# Altium schematic sheet omoko_Battery_Charger.SchDoc
size 457 x 381 mm; PageSetup: Record=PageOptions|CenterHorizontal=True|CenterVertical=True|PrintScale=0.54|XCorrection=1.00|YCorrection=1.00|PrintKind=1|BorderSize=5000000|LeftOffset=0|BottomOffset=0|Orientation=2|PaperLength=1000|PaperWidth=1000|Scale=100|PaperSource=7|PrintQuality=-3|MediaType=1|DitherType=10|PrintScaleMode=1|PaperKind=Executive|PaperIndex=7
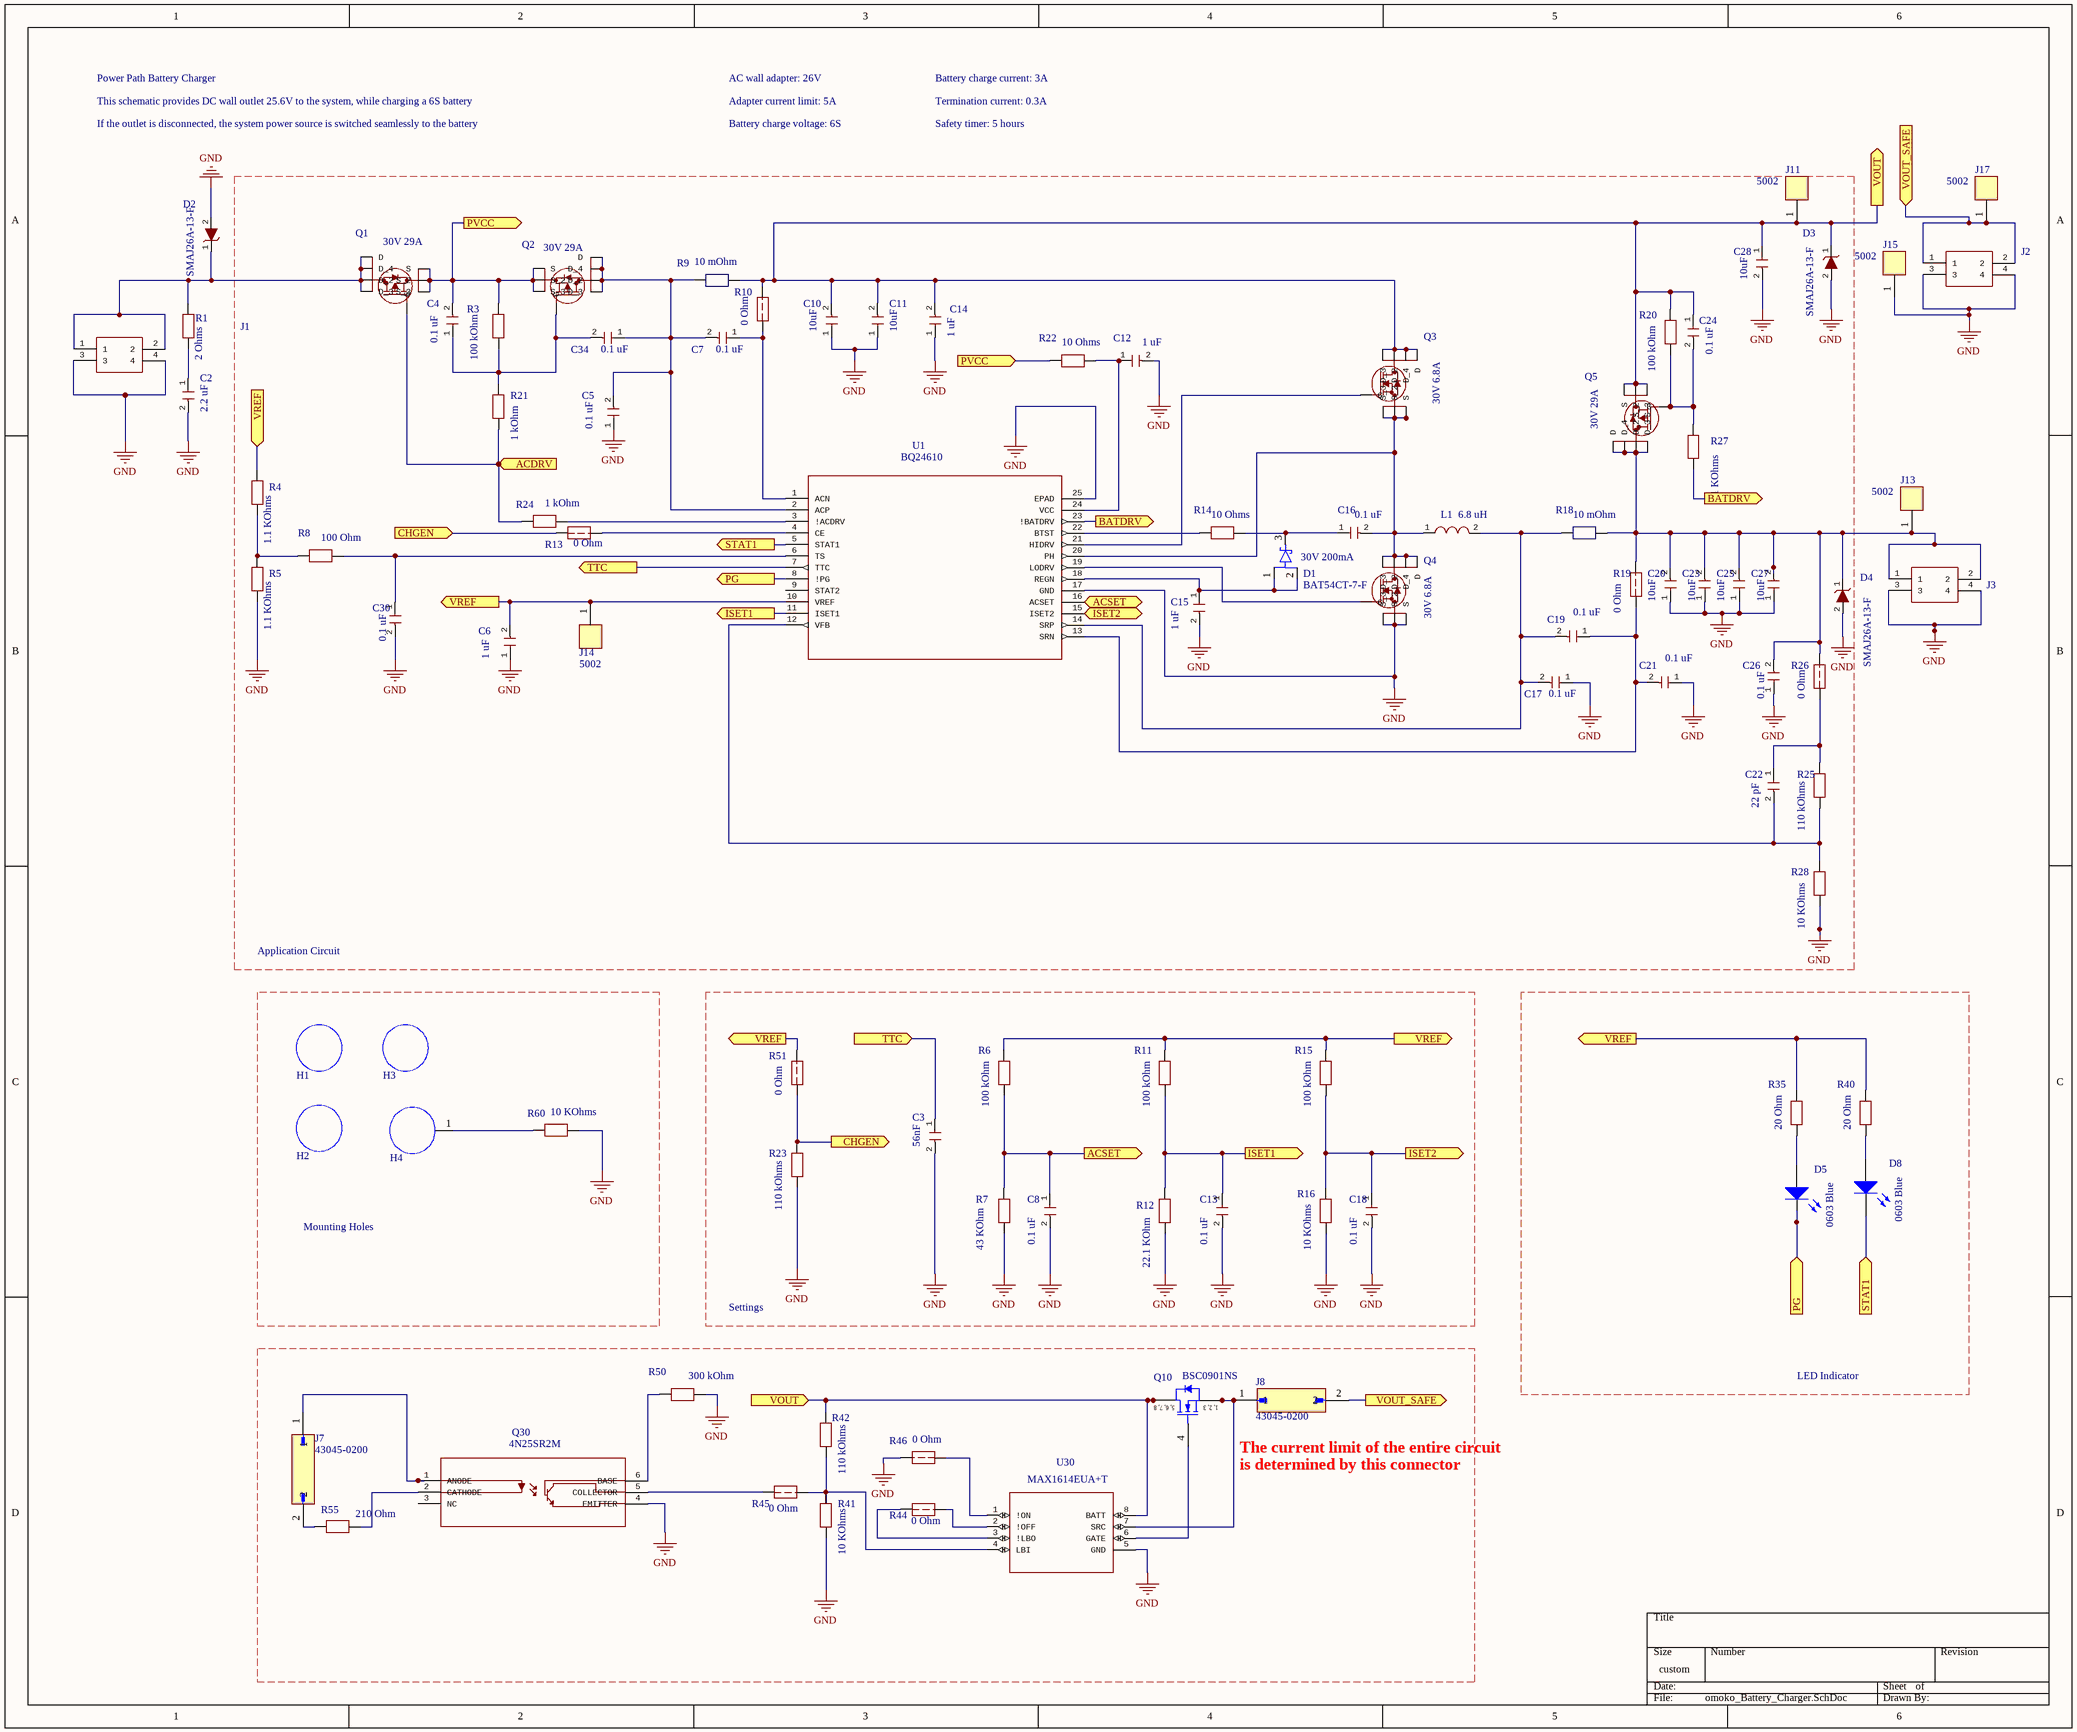
[diagram p0: omoko_Battery_Charger.SchDoc]

## Parts
C2  value 2.2 uF  [CAP_0603]  (hidden comment: GRM188R6YA225KA12D)
C3  value 56nF  [RES_0603]  (hidden comment: CC0603KRX7R9BB563)
C4  value 0.1 uF  [CAP_0603]  (hidden comment: CL10B104KB8NNNC)
C5  value 0.1 uF  [CAP_0603]  (hidden comment: CL10B104KB8NNNC)
C6  value 1 uF  [CAP_0603]  (hidden comment: GCM188R71C105KA64)
C7  value 0.1 uF  [CAP_0603]  (hidden comment: CL10B104KB8NNNC)
C8  value 0.1 uF  [CAP_0603]  (hidden comment: CL10B104KB8NNNC)
C10  value 10uF  [CAP_1210]  (hidden comment: GRM32ER71H106KA12L)
C11  value 10uF  [CAP_1210]  (hidden comment: GRM32ER71H106KA12L)
C12  value 1 uF  [CAP_0603]  (hidden comment: GRT188R61H105KE13D)
C13  value 0.1 uF  [CAP_0603]  (hidden comment: CL10B104KB8NNNC)
C14  value 1 uF  [CAP_0603]  (hidden comment: GRT188R61H105KE13D)
C15  value 1 uF  [CAP_0603]  (hidden comment: GCM188R71C105KA64)
C16  value 0.1 uF  [CAP_0603]  (hidden comment: CL10B104KB8NNNC)
C17  value 0.1 uF  [CAP_0603]  (hidden comment: CL10B104KB8NNNC)
C18  value 0.1 uF  [CAP_0603]  (hidden comment: CL10B104KB8NNNC)
C19  value 0.1 uF  [CAP_0603]  (hidden comment: CL10B104KB8NNNC)
C20  value 10uF  [CAP_1210]  (hidden comment: GRM32ER71H106KA12L)
C21  value 0.1 uF  [CAP_0603]  (hidden comment: CL10B104KB8NNNC)
C22  value 22 pF  [CAP_0603]  (hidden comment: CL10C220JB8NNNC)
C23  value 10uF  [CAP_1210]  (hidden comment: GRM32ER71H106KA12L)
C24  value 0.1 uF  [CAP_0603]  (hidden comment: CL10B104KB8NNNC)
C25  value 10uF  [CAP_1210]  (hidden comment: GRM32ER71H106KA12L)
C26  value 0.1 uF  [CAP_0603]  (hidden comment: CL10B104KB8NNNC)
C27  value 10uF  [CAP_1210]  (hidden comment: GRM32ER71H106KA12L)
C28  value 10uF  [CAP_1210]  (hidden comment: GRM32ER71H106KA12L)
C30  value 0.1 uF  [CAP_0603]  (hidden comment: CL10B104KB8NNNC)
C34  value 0.1 uF  [CAP_0603]  (hidden comment: CL10B104KB8NNNC)
D1  BAT54CT-7-F  value 30V 200mA  [DIODE_SOT-523]
D2  SMAJ26A-13-F  [DIODE_DO-214AC]
D3  SMAJ26A-13-F  [DIODE_DO-214AC]
D4  SMAJ26A-13-F  [DIODE_DO-214AC]
D5  0603 Blue  [0603_LED_S1]
D8  0603 Blue  [0603_LED_S1]
H1  M3 not plated  [M3 not plated]  (value not drawn)
H2  M3 not plated  [M3 not plated]  (value not drawn)
H3  M3 not plated  [M3 not plated]  (value not drawn)
H4  M3 plated  [M3 plated]  (value not drawn)
J1  4 way r/a PCB header w/peg,Mini-Fit Jr Molex MINI-FIT JR. Series, Series Number 5569, 4.2mm Pitch 4 Way 2 Row Shrouded Right Angle PCB Header, Through Hole   Source:  Datasheet  [MOLEX_39-30-1040]  (value not drawn)
J2  4 way r/a PCB header w/peg,Mini-Fit Jr Molex MINI-FIT JR. Series, Series Number 5569, 4.2mm Pitch 4 Way 2 Row Shrouded Right Angle PCB Header, Through Hole   Source:  Datasheet  [MOLEX_39-30-1040]  (value not drawn)
J3  4 way r/a PCB header w/peg,Mini-Fit Jr Molex MINI-FIT JR. Series, Series Number 5569, 4.2mm Pitch 4 Way 2 Row Shrouded Right Angle PCB Header, Through Hole   Source:  Datasheet  [MOLEX_39-30-1040]  (value not drawn)
J7  43045-0200  [MOLEX_43045-0200]
J8  43045-0200  [MOLEX_43045-0200]
J11  5002  [KEYSTONE_5002]
J13  5002  [KEYSTONE_5002]
J14  5002  [KEYSTONE_5002]
J15  5002  [KEYSTONE_5002]
J17  5002  [KEYSTONE_5002]
L1  value 6.8 uH  [IND_5450]  (hidden comment: ASPI-1367-6R8M-T)
Q1  value 30V 29A  [MOSFET_SOIC-8]  (hidden comment: SI4459ADY)
Q2  value 30V 29A  [MOSFET_SOIC-8]  (hidden comment: SI4459ADY)
Q3  value 30V 6.8A  [MOSFET-SO-8]  (hidden comment: NTMS4816NR2G)
Q4  value 30V 6.8A  [MOSFET-SO-8]  (hidden comment: NTMS4816NR2G)
Q5  value 30V 29A  [MOSFET_SOIC-8]  (hidden comment: SI4459ADY)
Q10  BSC0901NS  [MOSFET_PG-TDSON-8(6x5)]
Q30  4N25SR2M  [OPTO_SMD-6]
R1  value 2 Ohms  [RES_2512]  (hidden comment: AC2512FK-072RL)
R3  value 100 kOhm  [RES_0603]  (hidden comment: ERJ3GEYJ104V)
R4  value 1.1 KOhms  [RES_0603]  (hidden comment: ERJ3EKF1101V)
R5  value 1.1 KOhms  [RES_0603]  (hidden comment: ERJ3EKF1101V)
R6  value 100 kOhm  [RES_0603]  (hidden comment: ERJ3GEYJ104V)
R7  value 43 KOhm  [RES_0603]  (hidden comment: ERJ3GEYJ433V)
R8  value 100 Ohm  [RES_0603]  (hidden comment: ERJU3RD1000V)
R9  value 10 mOhm  [RES_0805]  (hidden comment: ERJ6CWFR010V)
R10  value 0 Ohm  [RES_0603]  (hidden comment: ERJ3GEY0R00V)
R11  value 100 kOhm  [RES_0603]  (hidden comment: ERJ3GEYJ104V)
R12  value 22.1 KOhm  [RES_0603]  (hidden comment: ERJ3RBD2212V)
R13  value 0 Ohm  [RES_0603]  (hidden comment: ERJ3GEY0R00V)
R14  value 10 Ohms  [RES_0805]  (hidden comment: ERJ-P06F10R0V)
R15  value 100 kOhm  [RES_0603]  (hidden comment: ERJ3GEYJ104V)
R16  value 10 KOhms  [RES_0603]  (hidden comment: ERJ3GEYJ103V)
R18  value 10 mOhm  [RES_0805]  (hidden comment: ERJ6CWFR010V)
R19  value 0 Ohm  [RES_0603]  (hidden comment: ERJ3GEY0R00V)
R20  value 100 kOhm  [RES_0603]  (hidden comment: ERJ3GEYJ104V)
R21  value 1 kOhm  [RES_0603]  (hidden comment: ERJ3GEYJ102V)
R22  value 10 Ohms  [RES_0805]  (hidden comment: ERJ-P06F10R0V)
R23  value 110 kOhms  [RES_0603]  (hidden comment: ERJ3EKF1103V)
R24  value 1 kOhm  [RES_0603]  (hidden comment: ERJ3GEYJ102V)
R25  value 110 kOhms  [RES_0603]  (hidden comment: ERJ3EKF1103V)
R26  value 0 Ohm  [RES_0603]  (hidden comment: ERJ3GEY0R00V)
R27  value 1.1 KOhms  [RES_0603]  (hidden comment: ERJ3EKF1101V)
R28  value 10 KOhms  [RES_0603]  (hidden comment: ERJ3GEYJ103V)
R35  value 20 Ohm  [RES_0603]  (hidden comment: ERJ3GEYJ200V)
R40  value 20 Ohm  [RES_0603]  (hidden comment: ERJ3GEYJ200V)
R41  value 10 KOhms  [RES_0603]  (hidden comment: ERJ3GEYJ103V)
R42  value 110 kOhms  [RES_0603]  (hidden comment: ERJ3EKF1103V)
R44  value 0 Ohm  [RES_0603]  (hidden comment: ERJ3GEY0R00V)
R45  value 0 Ohm  [RES_0603]  (hidden comment: ERJ3GEY0R00V)
R46  value 0 Ohm  [RES_0603]  (hidden comment: ERJ3GEY0R00V)
R50  value 300 kOhm  [RES_0603]  (hidden comment: ERJ3GEYJ304V)
R51  value 0 Ohm  [RES_0603]  (hidden comment: ERJ3GEY0R00V)
R55  value 210 Ohm  [RES_0603]  (hidden comment: ERJ3EKF2100V)
R60  value 10 KOhms  [RES_0603]  (hidden comment: ERJ3GEYJ103V)
U1  BQ24610  [QFN-24_EP_4.0x4.0x0.5P]
U30  MAX1614EUA+T  [DRIVER_MSOP-8]

## Blocks framed on the sheet
Application Circuit: C4-C7 C10-C12 C14-C17 C19-C28 C30 C34 D1 D3 D4 J11 J14 L1 Q1-Q5 R3-R5 R8-R10 R13 R14 R18-R22 R24-R28 U1
Mounting Holes: H1-H4 R60
Settings: C3 C8 C13 C18 R6 R7 R11 R12 R15 R16 R23 R51
LED Indicator: D5 D8 R35 R40

## Ports
ACDRV (in), ACSET (out), BATDRV (out), CHGEN (in), CHGEN (out), ISET1 (out), ISET2 (out), PG (in), PG (out), PVCC (in), PVCC (out), STAT1 (in), STAT1 (out), TTC (in), TTC (out), VOUT (in), VOUT (out), VOUT_SAFE (in), VOUT_SAFE (out), VREF (in), VREF (out)

## Nets
GND: C2.2 C3.2 C5.1 C6.1 C8.2 C10.1 C11.1 C12.2 C13.2 C14.1 C15.2 C17.1 C18.2 C20.1 C21.1 C23.1 C25.1 C26.1 C27.1 C28.2 C30.2 D2.2 D3.2 D4.2 J1.3 J1.4 J2.3 J2.4 J3.3 J3.4 J15.1 Q4.1(S_3) Q4.2(S_2) Q4.3(S) Q30.4(EMITTER) R5.1 R7.1 R12.1 R16.1 R23.1 R28.1 R41.1 R46.2 R50.2 R60.2 U1.17(GND) U1.25(EPAD) U30.5(GND)
ACDRV: Q1.4(G) R21.1 R24.1 ; port ACDRV
ACSET: C8.1 R6.1 R7.2 U1.16(ACSET) ; port ACSET
BATDRV: R27.1 U1.23(!BATDRV) ; port BATDRV
CHGEN: R13.1 R23.2 R51.1 ; port CHGEN
ISET1: C13.1 R11.1 R12.2 U1.11(ISET1) ; port ISET1
ISET2: C18.1 R15.1 R16.2 U1.15(ISET2) ; port ISET2
PG: D5.K U1.8(!PG) ; port PG
PVCC: C4.2 Q1.1(S_3) Q1.2(S_2) Q1.3(S) Q2.1(S_3) Q2.2(S_2) Q2.3(S) R3.2 R22.1 ; port PVCC
STAT1: D8.K U1.5(STAT1) ; port STAT1
TTC: C3.1 U1.7(TTC) ; port TTC
VOUT: C10.2 C11.2 C14.2 C24.1 C28.1 D3.1 J11.1 Q3.5(D_3) Q3.6(D_2) Q3.7(D_4) Q3.8(D) Q5.1(S_3) Q5.2(S_2) Q5.3(S) Q10.5(DRAIN) Q10.6(DRAIN) Q10.7(DRAIN) Q10.8(DRAIN) R9.2 R10.2 R20.2 R42.2 U30.8(BATT) ; port VOUT
VOUT_SAFE: J2.1 J2.2 J8.2 J17.1 ; port VOUT_SAFE
VREF: C6.2 J14.1 R4.2 R6.2 R11.2 R15.2 R35.2 R40.2 R51.2 U1.10(VREF) ; port VREF
NetC2_1: C2.1 R1.1
NetC4_1: C4.1 C34.2 Q2.4(G) R3.1 R21.2
NetC5_2: C5.2 C7.2 C34.1 Q2.5(D_3) Q2.6(D_2) Q2.7(D_4) Q2.8(D) R9.1 U1.2(ACP)
NetC7_1: C7.1 R10.1 U1.1(ACN)
NetC12_1: C12.1 R22.2 U1.24(VCC)
NetC15_1: C15.1 D1.1(A_1) D1.2(A_2) U1.18(REGN)
NetC16_1: C16.1 D1.3(K) R14.2
NetC16_2: C16.2 L1.1 Q3.1(S_3) Q3.2(S_2) Q3.3(S) Q4.5(D_3) Q4.6(D_2) Q4.7(D_4) Q4.8(D) U1.20(PH)
NetC17_2: C17.2 C19.2 L1.2 R18.1 U1.14(SRP)
NetC19_1: C19.1 C21.2 R19.1 U1.13(SRN)
NetC20_2: C20.2 C23.2 C25.2 C26.2 C27.2 D4.1 J3.1 J3.2 J13.1 Q5.5(D_3) Q5.6(D_2) Q5.7(D_4) Q5.8(D) R18.2 R19.2 R26.2
NetC22_1: C22.1 R25.2 R26.1
NetC22_2: C22.2 R25.1 R28.2 U1.12(VFB)
NetC24_2: C24.2 Q5.4(G) R20.1 R27.2
NetC30_1: C30.1 R8.2 U1.6(TS)
NetD2_1: D2.1 J1.1 J1.2 Q1.5(D_3) Q1.6(D_2) Q1.7(D_4) Q1.8(D) R1.2
NetD5_A: D5.A R35.1
NetD8_A: D8.A R40.1
NetH4_1: H4.1 R60.1
NetJ7_1: J7.1 Q30.1(ANODE)
NetJ7_2: J7.2 R55.1
NetJ8_1: J8.1 Q10.1(SOURCE) Q10.2(SOURCE) Q10.3(SOURCE) U30.7(SRC)
NetQ3_4: Q3.4(G) U1.21(HIDRV)
NetQ4_4: Q4.4(G) U1.19(LODRV)
NetQ10_4: Q10.4(GATE) U30.6(GATE)
NetQ30_2: Q30.2(CATHODE) R55.2
NetQ30_5: Q30.5(COLLECTOR) R45.1
NetQ30_6: Q30.6(BASE) R50.1
NetR4_1: R4.1 R5.2 R8.1
NetR13_2: R13.2 U1.4(CE)
NetR14_1: R14.1 U1.22(BTST)
NetR24_2: R24.2 U1.3(!ACDRV)
NetR41_2: R41.2 R42.1 R45.2 U30.4(LBI)
NetR44_1: R44.1 U30.3(!LBO)
NetR44_2: R44.2 U30.2(!OFF)
NetR46_1: R46.1 U30.1(!ON)

Not connected (* = marked no-connect by the designer): Q30 3(NC); U1 9(STAT2)

## Notes on the sheet
- Power Path Battery Charger
- AC wall adapter: 26V
- Battery charge current: 3A
- This schematic provides DC wall outlet 25.6V to the system, while charging a 6S battery
- If the outlet is disconnected, the system power source is switched seamlessly to the battery
- Adapter current limit: 5A
- Battery charge voltage: 6S
- Termination current: 0.3A
- Safety timer: 5 hours
- The current limit of the entire circuit
- is determined by this connector
- (in symbol BSC0901NS) 5, 6, 7, 8; 1, 2, 3

## Library data of the parts
C2 = GCM31CR71H225KA55L: Cap Ceramic 2.2uF 35V 0603; Manufacturer: Murata Electronics; Link: https://www.digikey.ca/en/products/detail/murata-electronics/GRM188R6YA225KA12D/3900462?s=N4IgTCBcDaIOICUCyBGAHGhA2AmgQTDAFYBpPFMAERAF0BfIA; Package: 0603; PartNumber: GRM188R6YA225KA12D; SupplierPartNumber: 490-7204-2-ND; SuppliersPartNumber: C86017
C3 = CC0603KRX7R9BB563: Cap Ceramic 56nF 16V 0402; Manufacturer: YAGEO; Package: 0603; Link: https://www.digikey.ca/en/products/detail/yageo/CC0603KRX7R9BB563/5883809?s=N4IgTCBcDaIMJwAwDZEGYDSAlAGgdiwE4AhYgVmTRAF0BfIA; PartNumber: CC0603KRX7R9BB563; SupplierPartNumber: 311-4100-2-ND; SuppliersPartNumber: C282072
C4 C5 C7 C8 C13 C16-C19 C21 C24 C26 C30 C34 = CL10B104KB8NNNC: Cap Ceramic 0.1uF 50V 0603; Manufacturer_Name: Samsung; Link: https://www.digikey.ca/en/products/detail/samsung-electro-mechanics/CL10B104KB8NNNC/3886658?s=N4IgTCBcDaIMIBkCMAGAQqgLAaTQDgDki4QBdAXyA; Package: 0603; PartNumber: CL10B104KB8NNNC; SupplierPartNumber: 1276-1000-2-ND; SuppliersPartNumber: C1591
C6 C15 = GCM188R71C105KA64D: Cap Ceramic 1uF 16V 0603; Manufacturer_Name: Murata Electronics; GateName_1: G$1; SymbolName_1: GCM188R71C105KA64D; LibraryName: GCM188R71C105KA64D; DeviceSetName: GCM188R71C105KA64D; Manufacturer_Part_Number: GCM188R71C105KA64D; Mouser_Part_Number: 81-GCM188R71C105K64D; Mouser_Price-Stock: https://www.mouser.co.uk/ProductDetail/Murata-Electronics/GCM188R71C105KA64D?qs=bQrJpfqjX%252BKtVgLYIBGvIg%3D%3D; Arrow_Part_Number: GCM188R71C105KA64D; Arrow_Price-Stock: https://www.arrow.com/en/products/gcm188r71c105ka64d/murata-manufacturing?region=nac; Height: 0.9mm; Link: https://www.digikey.ca/en/products/detail/murata-electronics/GCM188R71C105KA64D/1979250; Package: 0603; PartNumber: GCM188R71C105KA64; SupplierPartNumber: 490-5241-2-ND; SuppliersPartNumber: C161212
C10 C11 C20 C23 C25 C27 C28 = GRM32ER71H106KA12L: Cap Ceramic 10uF 50V 1210; Manufacturer_Name: Murata Electronics; GateName_1: G$1; SymbolName_1: GRM32ER71H106KA12L; LibraryName: GRM32ER71H106KA12L; DeviceSetName: GRM32ER71H106KA12L; Manufacturer_Part_Number: GRM32ER71H106KA12L; Mouser_Part_Number: 81-GRM32ER71H106KA2L; Mouser_Price-Stock: https://www.mouser.co.uk/ProductDetail/Murata-Electronics/GRM32ER71H106KA12L?qs=6pxx44s1bjkjdm74o%2FrKhg%3D%3D; Arrow_Part_Number: GRM32ER71H106KA12L; Arrow_Price-Stock: https://www.arrow.com/en/products/grm32er71h106ka12l/murata-manufacturing; Height: 2.7mm; Link: https://www.digikey.ca/en/products/detail/murata-electronics/GRM32ER71H106KA12L/2548481?s=N4IgTCBcDaIOICUCyBmMBRBB2AjACRwAYA2AaQEEcwAZEAXQF8g; Package: 1210; PartNumber: GRM32ER71H106KA12L; SupplierPartNumber: 490-6544-1-ND; SuppliersPartNumber: C77102
C12 C14 = GRT188R61H105KE13D: Cap Ceramic 1uF 50V 0603; Manufacturer: Murata Electronics; PartNumber: GCM188R71C105KA64; Link: https://www.digikey.ca/en/products/detail/murata-electronics/GRT188R61H105KE13D/5416752?s=N4IgTCBcDaIOICUAqBGAHGhA2FAJFADAKwDSAoigMwAiIAugL5A; Package: 0603; SupplierPartNumber: 490-12330-2-ND; SuppliersPartNumber: C126631
C22 = CL10C220JB8NNNC: Cap Ceramic 22pF 50V 0603; Manufacturer: Samsung Electro-Mechanics; Link: https://www.digikey.ca/en/products/detail/samsung-electro-mechanics/CL10C220JB8NNNC/3886681?s=N4IgTCBcDaIMIBkCMAGOYwoFICEAcAckXCALoC%2BQA; Package: 0603; PartNumber: CL10C220JB8NNNC; SupplierNumber: 1276-1023-2-ND; SuppliersPartNumber: C1653
D1 = BAT54CT-7-F: Diode Schottky 30V 200mA; Manufacturer_Name: Diodes Inc.; GateName_1: G$1; SymbolName_1: BAT54CT-7-F; LibraryName: BAT54CT-7-F; DeviceSetName: BAT54CT-7-F; Manufacturer_Part_Number: BAT54CT-7-F; Mouser_Part_Number: 621-BAT54CT-F; Mouser_Price-Stock: https://www.mouser.co.uk/ProductDetail/Diodes-Incorporated/BAT54CT-7-F?qs=eZWE0vXsHCE8vHna85fvBQ%3D%3D; Arrow_Part_Number: BAT54CT-7-F; Arrow_Price-Stock: https://www.arrow.com/en/products/bat54ct-7-f/diodes-incorporated?region=nac; Height: 0.9mm; Link: https://www.digikey.ca/en/products/detail/diodes-incorporated/BAT54CT-7-F/717703; Package: SOT-523; PartNumber: BAT54CT-7-F; SupplierPartNumber: BAT54CT-FDITR-ND; SuppliersPartNumber: C134407
D2-D4 = SMAJ26A-13-F: Diode TVS 26V; Mfr_Name: Diodes Inc; GateName_1: A; DeviceName: SMA_DIO; SymbolName_1: DIODE; LibraryName: 2022-09-06_21-11-13_Library; DeviceSetName: SMAJ26A-13-F; Copyright: Copyright (C) 2022 Ultra Librarian. All rights reserved.; Manufacturer_Part_Number: SMAJ26A-13-F; Digi-Key_Part_Number_1: SMAJ26A-FDICT-ND; Digi-Key_Part_Number_2: SMAJ26A-FDIDKR-ND; Digi-Key_Part_Number_3: SMAJ26A-FDITR-ND; Link: https://www.digikey.ca/en/products/detail/diodes-incorporated/SMAJ26A-13-F/806555?s=N4IgTCBcDaIMoFkCCApMA2JBaAjAZiwDEQBdAXyA; Package: DO-214AC; PartNumber: SMAJ26A-13-F; SupplierPartNumber: SMAJ26A-FDITR-ND; SuppliersPartNumber: C134975
D5 D8 = 0603 LED Blue: LED; ComponentLink1Description: 供应商链接; ComponentLink1URL: http://www.szlcsc.com/product/details_73150.html; Package: 0603; Supplier: LC; SuppliersPartNumber: C72041; Color: Blue
H1-H3 = M3 not plated: M3 hole not plated
H4 = M3 plated: M3 hole plated
J1-J3 = 39-30-1040: Molex Minifit 4POS; PartNumber: 39-30-1040; Manufacturer: Molex; SuppliersPartNumber: *; SupplierNumber: 538-39-30-1040; Link: https://www.mouser.ca/ProductDetail/Molex/39-30-1040?qs=tRPrwvvr%2FugKtPXHFlZTbg%3D%3D; Value: *; Package: *
J7 J8 = 43045-0200: Molex Microfit 2POS; SupplerNumber: WM1813-ND; MF: Molex; Digi-Key_Part_Number: WM1813-ND; SnapEDA_Link: https://www.snapeda.com/parts/43045-0200/Molex/view-part/?ref=snap; Purchase-URL: https://pricing.snapeda.com/search/part/43045-0200/?ref=eda; Package: None; MP: 43045-0200; Check_prices: https://www.snapeda.com/parts/43045-0200/Molex/view-part/?ref=eda; Value: *; PartNumber: 43045-0200; Link: https://www.digikey.ca/en/products/detail/molex/0430450200/252526?s=N4IgTCBcDaICwGYAMcCsBaJYlJAXQF8g
J11 J13-J15 J17 = 5002: Test Point Ring Keystone; Manufacturer: Keystone Electronics; Value: Test Point Keystone Electronics; Package: *; PartNumber: 5002; SupplierNumber: 36-5002-ND; SuppliersPartNumber: C238123; Link: https://www.digikey.ca/en/products/detail/keystone-electronics/5002/255328
L1 = ASPI-1367-100M-TASPI-1367-100M-T_ABR: Ind 6.8uH; Mfr_Name: Abracon; GateName_1: A; SymbolName_1: ASPI-1367-100M-T; DeviceName: ASPI-1367-100M-T_ABR; LibraryName: 2022-08-03_18-57-08_Library; DeviceSetName: ASPI-1367-100M-T; Copyright: Copyright (C) 2022 Ultra Librarian. All rights reserved.; Manufacturer_Part_Number: ASPI-1367-100M-T; Link: https://www.digikey.ca/en/products/detail/abracon-llc/ASPI-1367-6R8M-T/2343319?s=N4IgTCBcDaIIIGUAKBJAtARgMwDYDsaOASgBwCyaAKiALoC%2BQA; Package: 5450; PartNumber: ASPI-1367-6R8M-T; SupplierPartNumber: ASPI-1367-6R8M-TCT-ND; SuppliersPartNumber: C187379
Q1 Q2 Q5 = SI4459ADY-T1-GE3SO_ADY-T1-GE3_VIS-M: P-Channel 30V 29A 5mOHm; Mfr_Name: Vishay; Manufacturer_Part_Number: SI4459ADY-T1-GE3; Link: https://www.digikey.ca/en/products/detail/vishay-siliconix/SI4459ADY-T1-GE3/1978849?s=N4IgTCBcDaIMoEkAsSCsBOAggEQJoFoAVARnwHEBRAZhAF0BfIA; Package: SOIC-8; PartNumber: SI4459ADY-T1-GE3; SupplierNumber: SI4459ADY-T1-GE3TR-ND; SuppliersPartNumber: C143743
Q3 Q4 = NTMS4816NR2G: N-channel 30V 6.8A; Mfr_Name: OnSemi; Manufacturer_Part_Number: NTMS4816NR2G; Link: https://www.digikey.ca/en/products/detail/onsemi/NTMS4816NR2G/1793059?s=N4IgTCBcDaIHIBUCyBlALADgIwDY4CUwBxEAXQF8g; Package: SO-8; SupplierPartNumber: NTMS4816NR2G; SuppliersPartNumber: C179627
Q10 = BSC0901NS: N-Channel 30V 28A 1.9mOhm; Manufacturer: Infineon Technologies; Value: 30V 28A; Package: PG-TDSON-8; SupplierNumber: BSC0901NSATMA1TR-ND; SuppliersPartNumber: C152424; PartNumber: BSC0901NS; Link: https://www.digikey.ca/en/products/detail/infineon-technologies/BSC0901NSATMA1/2527816
Q30 = 4N25SR2M: OPTO Transistor-base; Mfr_Name: onsemi; DeviceName: SMT-6L_ONS-M; LibraryName: 2022-09-12_19-10-23_Library; Value: *; Link: https://www.digikey.ca/en/products/detail/onsemi/4N25SR2M/400483; Package: FET_SMD-6; PartNumber: 4N25SR2M; SupplierPartNumber: 4N25SR2MTR-ND; SuppliersPartNumber: C44165
R1 = AC2512FK-072RL: Res 2Ohms 1W 2512; Link: https://www.mouser.ca/ProductDetail/YAGEO/AC2512FK-072RL?qs=tggtontpCXMQxwZ82qzu9Q%3D%3D; Package: 2512; PartNumber: AC2512FK-072RL; SupplierPartNumber: 603-AC2512FK-072RL; SuppliersPartNumber: C728171
R3 R6 R11 R15 R20 = ERJ3GEYJ104V: Res 100kOhm 1/10W 0603; Manufacturer_Name: Panasonic; Link: https://www.digikey.ca/en/products/detail/panasonic-electronic-components/ERJ-3GEYJ104V/135832?s=N4IgTCBcDaIKICUBSBmA4nAmkgjABgBYA1EAXQF8g; Package: 0603; SupplierPartNumber: P100KGTR-ND; SuppliersPartNumber: C278633; PartNumber: ERJ3GEYJ104V
R4 R5 R27 = ERJ3EKF1101V: Res 1.1KOhms 1/10W 0603; Link: https://www.mouser.ca/ProductDetail/Panasonic/ERJ-3EKF1101V?qs=zp1CF8hTeCiNy6F%252B%252B5%252BYzw%3D%3D; Package: 0603; PartNumber: ERJ3EKF1101V; SupplierPartNumber: 667-ERJ-3EKF1101V; SuppliersPartNumber: C402882
R7 = ERJ3GEYJ433V: Res 43KOhm 1/10W 0603; Manufacturer_Name: Panasonic; Height: 0.55mm; Link: https://www.digikey.ca/en/products/detail/panasonic-electronic-components/ERJ-3GEYJ433V/104624; Package: 0603; PartNumber: ERJ3GEYJ433V; SupplierPartNumber: P43KGTR-ND; SuppliersPartNumber: C403499
R8 = ERJU3RD1000V: Res 100Ohm 1/10W 0603; Manufacturer_Name: Panasonic; Link: https://www.digikey.ca/en/products/detail/panasonic-electronic-components/ERJ-U3RD1000V/12549636?s=N4IgTCBcDaIKICUBSBVAzAgIgRgAz4DUQBdAXyA; Package: 0603; SupplierPartNumber: 10-ERJ-U3RD1000VTR-ND; SuppliersPartNumber: C491168; PartNumber: ERJU3RD1000V
R9 R18 = ERJ6CWFR010V: Res 10mOhm 1/2W Sense Resistor 0805; Link: https://www.digikey.ca/en/products/detail/panasonic-electronic-components/ERJ-6CWFR010V/6004279?s=N4IgTCBcDaIKICUBSA2AwgdQGIIAwEZcA1EAXQF8g; Package: 0805; PartNumber: ERJ6CWFR010V; SupplierPartNumber: P19196CT-ND; SuppliersPartNumber: C236283
R10 R13 R19 R26 R44-R46 R51 = ERJ3GEY0R00V: Res 0Ohm 1/10W 0603; Link: https://www.digikey.ca/en/products/detail/panasonic-electronic-components/ERJ-3GEY0R00V/135656?s=N4IgTCBcDaIKICUBSBmA4nAmgBgd7AaiALoC%2BQA; Package: 0603; PartNumber: ERJ3GEY0R00V; SupplierPartNumber: P0.0GTR-ND; SuppliersPartNumber: C122704
R12 = ERJ3RBD2212V: Res 22.1KOhm 1/10W 0603; Manufacturer_Name: Panasonic; SymbolName_1: ERJ3RBD2212V; Manufacturer_Part_Number: ERJ3RBD2212V; Link: https://www.mouser.ca/ProductDetail/Panasonic/ERJ-3RBD2212V?qs=Xx7DtTQCah8CZLydlhyKZw%3D%3D; Package: 0603; PartNumber: ERJ3RBD2212V; SupplierPartNumber: 667-ERJ-3RBD2212V; SuppliersPartNumber: C416683
R14 R22 = ERJ-P06F10R0V: Res 10Ohms 1/2W 0805; Manufacturer_Name: Panasonic; PartNumber: ERJP06F10R0V; Link: https://www.digikey.ca/en/products/detail/panasonic-electronic-components/ERJ-P06F10R0V/5722444?s=N4IgTCBcDaIKICUBSAFADANgGIEY0LQDUQBdAXyA; Package: 0805; SupplierPartNumber: P18937DKR-ND; SuppliersPartNumber: C441969
R16 R28 R41 R60 = ERJ3GEYJ103V: Res 10KOhms 1/10W 0603; Link: https://www.mouser.ca/ProductDetail/Panasonic/ERJ-3GEYJ103V?qs=66DK8nO8gJBWgc%252B0VNNxzg%3D%3D; Package: 0603; PartNumber: ERJ3GEYJ103V; SupplierPartNumber: 667-ERJ-3GEYJ103V; SuppliersPartNumber: C169849
R21 R24 = ERJ3GEYJ102V: Res 1kOhm 1/10W 0603; Manufacturer_Name: Panasonic; SymbolName_1: ERJ3GEYJ102V; Link: https://www.digikey.ca/en/products/detail/panasonic-electronic-components/ERJ-3GEYJ102V/68472?s=N4IgTCBcDaIKICUBSBmA4nAmkgjABjADUQBdAXyA; Package: 0603; PartNumber: ERJ3GEYJ102V; SupplierPartNumber: P1.0KGCT-ND; SuppliersPartNumber: C180848
R23 R25 R42 = ERJ3EKF1103V: Res 110kOhms 1/10W 0603; LibraryName: ERJ3EKF1103V; Link: https://www.digikey.ca/en/products/detail/panasonic-electronic-components/ERJ-3EKF1103V/196091; Package: 0603; PartNumber: ERJ3EKF1103V; SupplierPartNumber: P110KHTR-ND; SuppliersPartNumber: C402884
R35 R40 = ERJ3GEYJ200V: Res 20Ohm 1/10W 0603; Manufacturer_Name: Panasonic; Link: https://www.digikey.ca/en/products/detail/panasonic-electronic-components/ERJ-3GEYJ200V/135597; Package: 0603; SupplierPartNumber: P20GTR-ND; SuppliersPartNumber: C403450; PartNumber: ERJ3GEYJ200V
R50 = ERJ3GEYJ304V: Res 300kOhm 1/10W 0603; Manufacturer_Name: Panasonic; Link: https://www.digikey.ca/en/products/detail/panasonic-electronic-components/ERJ-3GEYJ304V/135883; Package: 0603; SupplierPartNumber: P300KGTR-ND; SuppliersPartNumber: C403476; PartNumber: ERJ3GEYJ304V
R55 = ERJ3EKF2100V: Res 210Ohm 1/10W 0603; Manufacturer_Name: Panasonic; Link: https://www.digikey.ca/en/products/detail/panasonic-electronic-components/ERJ-3EKF2100V/196213?s=N4IgTCBcDaIKICUBSBmOBpAYmAjABjwDUQBdAXyA; Package: 0603; SupplierPartNumber: P210HTR-ND; SuppliersPartNumber: C403064; PartNumber: ERJ3EKF2100V
U1 = BQ24610RGERRGE24_2P45X2P45: Battery Charger IC BQ24610; Mfr_Name: Texas Instruments; GateName_1: A; SymbolName_1: BQ24610_RGE_24; DeviceName: RGE24_2P45X2P45; LibraryName: 2022-08-03_21-56-26_Library; DeviceSetName: BQ24610RGER; Copyright: Copyright (C) 2022 Ultra Librarian. All rights reserved.; Manufacturer_Part_Number: BQ24610RGER; LInk: *; Value: *; Package: QFN-24_EP_4.0x4.0x0.5P; SupplierPartNumber: https://www.rocelec.com/part/TISBQ24610RGER; SuppliersPartNumber: C19384; PartNumber: BQ24610
U30 = MAX1614EUA+T: GateDriver uMAX-8; Mfr_Name: Maxim Integrated Products; Value: uMAX-8; Link: https://www.digikey.ca/en/products/detail/analog-devices-inc-maxim-integrated/MAX1614EUA-T/1475620; Package: MSOP-8; PartNumber: MAX1614EUA+T; SupplierNumber: MAX1614EUA+TR-ND; SuppliersPartNumber: C2677104